# EAGLE design ttn_mad_v2_2 (EAGLE 6.5.0)
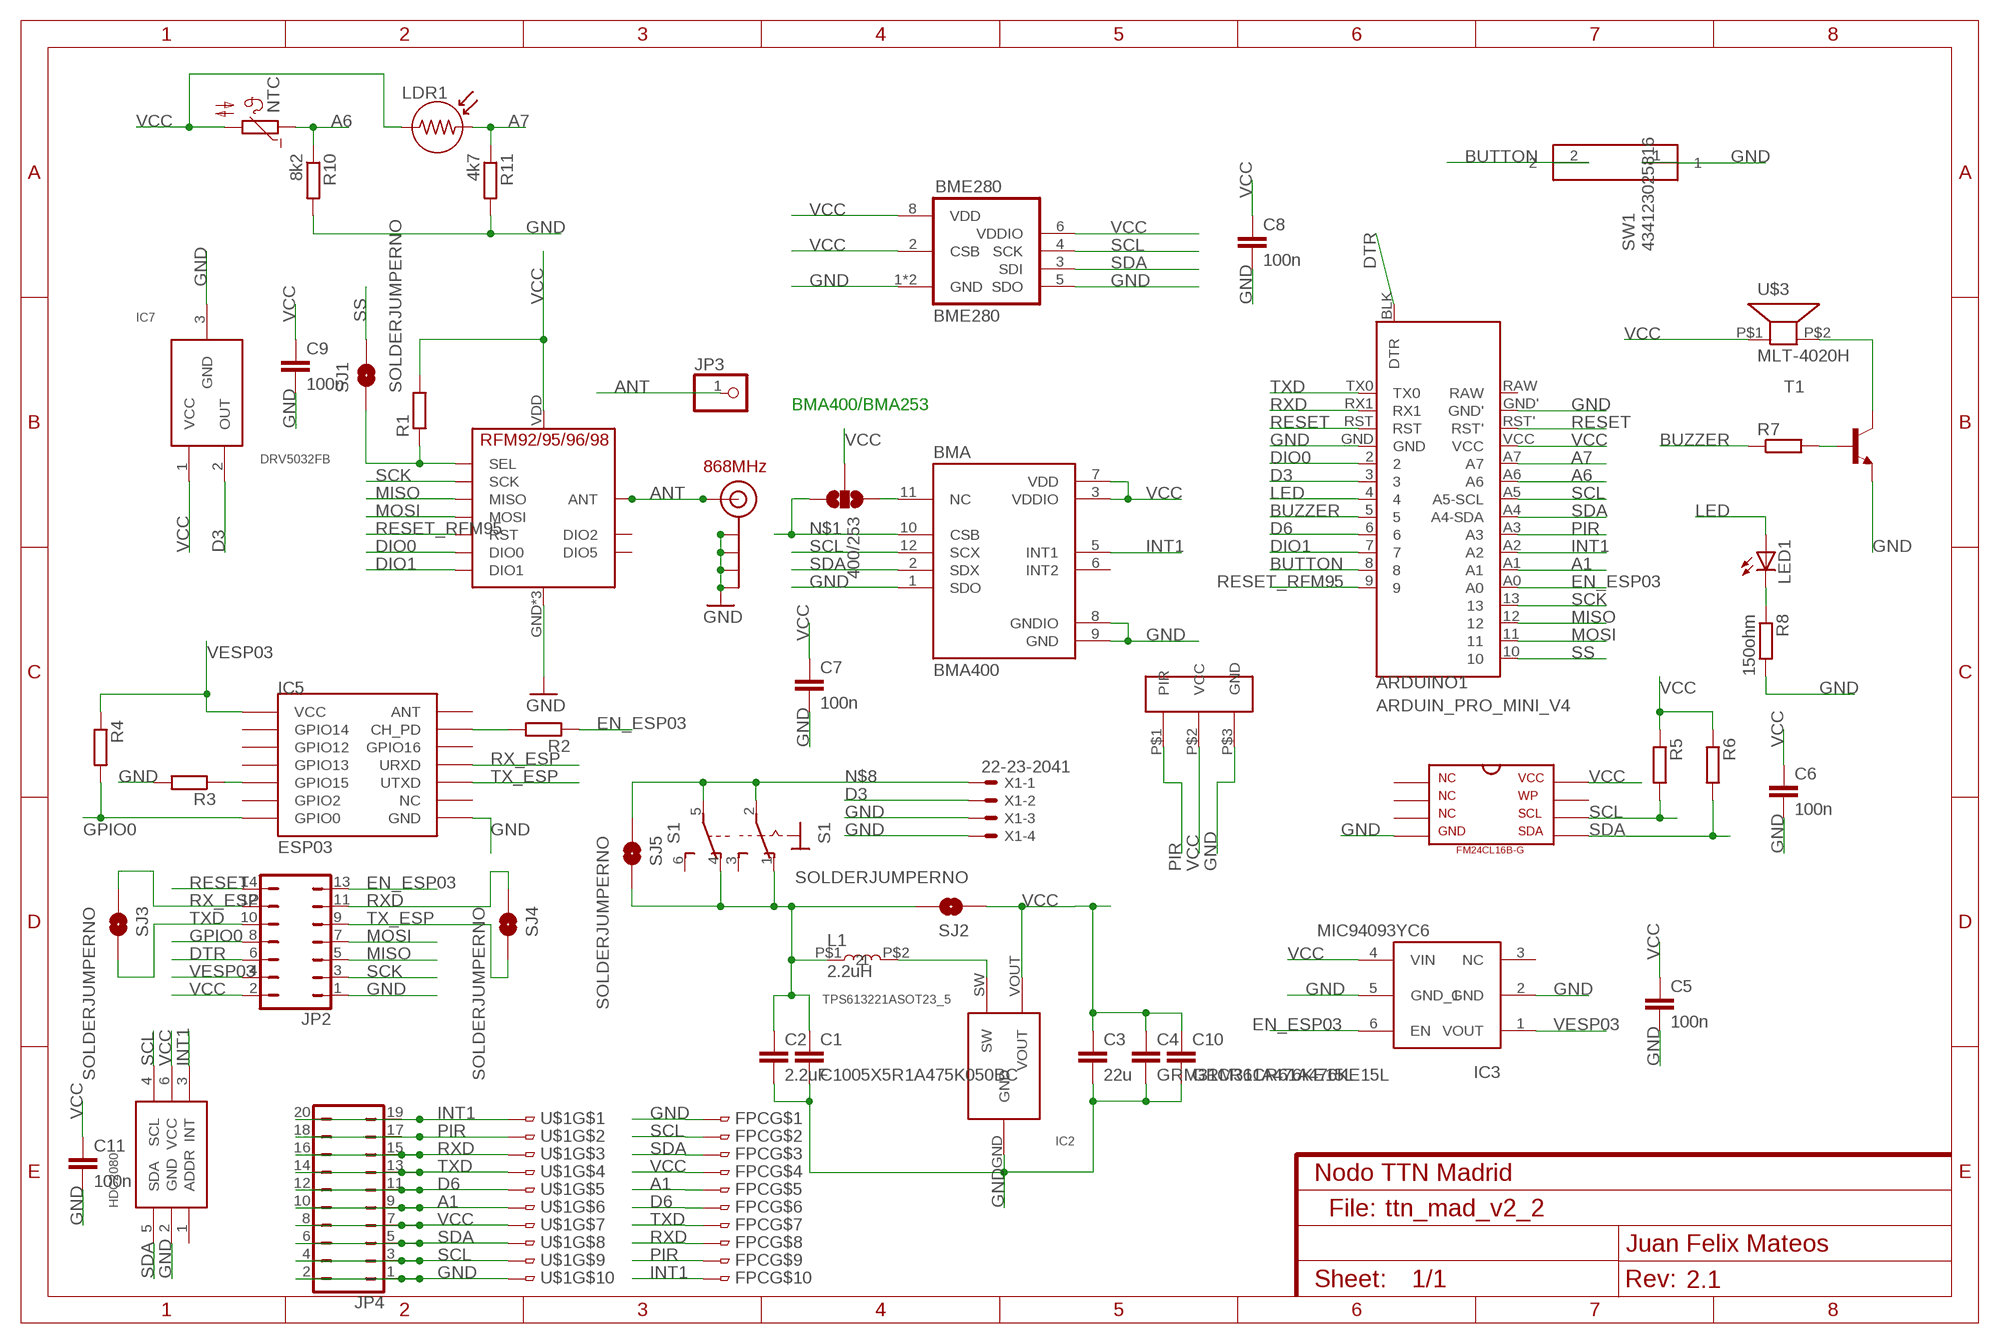
[diagram p0: schematic, sheet 1]
NAME (FRAME-A4L): CNAME: Nodo TTN Madrid; CREVISION: 2.1; DESIGNER: Juan Felix Mateos

## Parts
400/253  SOLDERJUMPER_2WAYT  [SJ_2]
ARDUINO1  ARDUIN_PRO_MINI_V4  [ARDUINO_PRO_MINI_V4]
BMA  BMA400  [IC_BMA400]
BME280  BME280  [BME280]
C1  C1005X5R1A475K050BC  C-EUC0603  [C0603]
C2  2.2uF  C-EUC0603  [C0603]
C3  22u  C-EUC0805  [C0805]
C4  GRM31CR61A476KE15L  C-EUC0805  [C0805]
C5  100n  C-EUC0603  [C0603]
C6  100n  C-EUC0603  [C0603]
C7  100n  C-EUC0603  [C0603]
C8  100n  C-EUC0603  [C0603]
C9  100n  C-EUC0603  [C0603]
C10  GRM31CR61A476KE15L  C-EUC0805  [C0805]
C11  100n  C-EUC0603  [C0603]
FM24  FM24CL16B-G  [FM24CL16B-G]
FPC  FPC_10P_0_5MM  [FH12-10S-0.5SH]
HDC2080  HDC2080  [WSON-6]
IC2  TPS613221ASOT23_5  [SOT23-5L]
IC3  MIC94093YC6  [SC70-6]
IC5  ESP03  [ESP03]
IC7  DRV5032FB  [SOT23]
J$2  ANTENNATINY  [SMA_UFL_PAD_TINY]
JP2  JP7Q  [JP7Q]
JP3  PINHD-1X1  [1X01]
JP4  JP10Q  [JP10Q]
L1  2.2uH  SRN2512  [SRN2512]
LDR1  LDR  [LDR]
LED1  LEDSMT1206  [1206]
NTC  NTC640  [P640]
R1  R-EU_R0603  [R0603]
R2  R-EU_R0603  [R0603]
R3  R-EU_R0603  [R0603]
R4  R-EU_R0603  [R0603]
R5  R-EU_R0603  [R0603]
R6  R-EU_R0603  [R0603]
R7  R-EU_R0603  [R0603]
R8  150ohm  R-EU_R0603  [R0603]
R10  8k2  R-EU_R0603  [R0603]
R11  4k7  R-EU_R0603  [R0603]
S1  TOGGLE_SWITCHTS_SMD  [TOGGLE_SWITCH_SMD]
SJ1  SOLDERJUMPERNO  [SJ_2S-NO]
SJ2  SOLDERJUMPERNO  [SJ_2S-NO]
SJ3  SOLDERJUMPERNO  [SJ_2S-NO]
SJ4  SOLDERJUMPERNO  [SJ_2S-NO]
SJ5  SOLDERJUMPERNO  [SJ_2S-NO]
SW1  434123025816  [434123025816]
T1  BC817-16-NPN-SOT23-BEC  [SOT23-BEC]
U$1  FPC_10P_0_5MM  [FH12-10S-0.5SH]
U$3  MLT-4020H  [MLT-4020H]
U$5  RFM95  [RFM95]
U$6  PIR  [PIR]
X1  22-23-2041  [22-23-2041]

## Nets
A1: ARDUINO1.A1 FPC.5 JP4.9 JP4.10 U$1.6
A6: ARDUINO1.A6 NTC.1 R10.1
A7: ARDUINO1.A7 LDR1.2 R11.1
ANT: J$2.ANT1(SIGNAL) J$2.ANT2(SIGNAL) J$2.ANT3(SIGNAL) JP3.1 U$5.ANT
BUTTON: ARDUINO1.8 SW1.2
BUZZER: ARDUINO1.5 R7.1
D3: ARDUINO1.3 IC7.2(OUT) X1.2
D6: ARDUINO1.6 FPC.6 JP4.11 JP4.12 U$1.5
DIO0: ARDUINO1.2 U$5.DIO0
DIO1: ARDUINO1.7 U$5.DIO1
DTR: ARDUINO1.BLK(DTR) JP2.6
EN_ESP03: ARDUINO1.A0 IC3.6(EN) JP2.13 R2.1
GND [power]: ARDUINO1.GND ARDUINO1.GND' BMA.1(SDO) BMA.8(GNDIO) BMA.9(GND) BME280.1(GND) BME280.5(SDO) BME280.7(GND) C1.2 C2.2 C3.2 C4.2 C5.2 C6.2 C7.2 C8.2 C9.2 C10.2 C11.2 FM24.4 FPC.1 HDC2080.2(GND) IC2.GND IC3.2(GND) IC3.5(GND_1) IC5.GND IC7.3(GND) J$2.GND1(GND) J$2.GND2(GND) J$2.GND3(GND) J$2.GND4(GND) JP2.1 JP4.1 JP4.2 R3.2 R8.2 R10.2 R11.2 SW1.1 T1.E U$1.10 U$5.GND U$5.GND1(GND) U$5.GND2(GND) U$6.P$3(GND) X1.3 X1.4
GPIO0: IC5.GPIO0 JP2.8 R4.2
INT1: ARDUINO1.A2 BMA.5(INT1) FPC.10 HDC2080.3(INT) JP4.19 JP4.20 U$1.1
LED: ARDUINO1.4 LED1.A
MISO: ARDUINO1.12 JP2.5 U$5.MISO
MOSI: ARDUINO1.11 JP2.7 U$5.MOSI
N$1: 400/253.3 BMA.10(CSB)
N$2: R1.1 SJ1.1 U$5.NSS(SEL)
N$3: IC2.SW L1.P$2
N$4: IC5.GPIO15 R3.1
N$5: T1.C U$3.P$2
N$6: 400/253.1 BMA.11(NC)
N$7: R7.2 T1.B
N$8 [power]: S1.2(1:P) S1.5(B:P) SJ5.1 X1.1
N$9: LED1.C R8.1
N$11: IC5.CH_PD R2.2
PIR: ARDUINO1.A3 FPC.9 JP4.17 JP4.18 U$1.2 U$6.P$1(PIR)
RESET: ARDUINO1.RST ARDUINO1.RST' JP2.14
RESET_RFM95: ARDUINO1.9 U$5.RST
RX_ESP: IC5.URXD JP2.12 SJ3.1
RXD: ARDUINO1.RX1 FPC.8 JP2.11 JP4.15 JP4.16 SJ4.1 U$1.3
SCK: ARDUINO1.13 JP2.3 U$5.SCK
SCL: ARDUINO1.A5(A5-SCL) BMA.12(SCX) BME280.4(SCK) FM24.6 FPC.2 HDC2080.4(SCL) JP4.3 JP4.4 R5.2 U$1.9
SDA: ARDUINO1.A4(A4-SDA) BMA.2(SDX) BME280.3(SDI) FM24.5 FPC.3 HDC2080.5(SDA) JP4.5 JP4.6 R6.2 U$1.8
SS: ARDUINO1.10 SJ1.2
TX_ESP: IC5.UTXD JP2.9 SJ4.2
TXD: ARDUINO1.TX0 FPC.7 JP2.10 JP4.13 JP4.14 SJ3.2 U$1.4
VCC [power]: 400/253.2 ARDUINO1.VCC BMA.3(VDDIO) BMA.7(VDD) BME280.2(CSB) BME280.6(VDDIO) BME280.8(VDD) C3.1 C4.1 C5.1 C6.1 C7.1 C8.1 C9.1 C10.1 C11.1 FM24.8 FPC.4 HDC2080.6(VCC) IC2.VOUT IC3.4(VIN) IC7.1(VCC) JP2.2 JP4.7 JP4.8 LDR1.1 NTC.2 R1.2 R5.1 R6.1 SJ2.1 U$1.7 U$3.P$1 U$5.VDD(VCC) U$6.P$2(VCC)
VCC_BAT [power]: C1.1 C2.1 L1.P$1 S1.1(1:O) S1.4(B:O) SJ2.2 SJ5.2
VESP03 [power]: IC3.1(VOUT) IC5.VCC JP2.4 R4.1
Unconnected: ARDUINO1.RAW BMA.6(INT2) FM24.1 FM24.2 FM24.3 FM24.7 HDC2080.1(ADDR) IC3.3(NC) IC5.ANT IC5.GPIO2 IC5.GPIO12 IC5.GPIO13 IC5.GPIO14 IC5.GPIO18(GPIO16) IC5.NC S1.3(1:S) S1.6(B:S) U$5.DIO2 U$5.DIO5

## Notes on the sheet
- BMA400/BMA253
- 868MHz
- File:

## Library data of the parts
400/253 = SparkFun-Passives:SOLDERJUMPER_2WAY: Solder Jumper 2 way solder jumper
ARDUINO1 = Arduino_Pro_Mini:ARDUIN_PRO_MINI_V4
BMA = BMA400:BMA400: Ultra low power, 12-bit digital triaxial accelerometer; AVAILABILITY: Unavailable; DESCRIPTION: Ultra low power, 12-bit digital triaxial accelerometer; MF: Bosch Sensortec; MP: BMA400; PACKAGE: LGA-12 Bosch Tools; PRICE: None
BME280 = bosch-bme280:BME280: DIGITAL HUMIDITY, PRESSURE AND TEMPERATURE SENSOR * Digital interface I²C (up to 3.4 MHz) and SPI (3 and 4 wire, up to 10 MHz)* Supply voltage VDD main supply voltage range: 1.71 V to 3.6 V*VDDIO interface voltage range: 1.2 V to 3.6 V Operating range -40…+85 °C, 0…100 % rel. humidity, 300…1100 hPa The library has been designed by Richard Magdycz <https://www.facebook.com/groups/eaglecadsoftUK>
C1-C11 = rcl:C-EU: CAPACITOR, European symbol
FM24 = FM24CL16B-G_fram:FM24CL16B-G: 16-Kbit (2K × 8) Serial (I2C) F-RAM
FPC U$1 = fpc_10pin_0_5mm:FPC_10P_0_5MM
HDC2080 = hdc2080:HDC2080
IC2 = TPS613221A:TPS613221A
IC3 = MIC94093YC6:MIC94093YC6
IC5 = esp8266modules:ESP03: ESP8266 Wifi module 03; DIMENSIONS: 17.3 x 12.1 mm; PINS: 14; PITCH: 0.078" / 2 mm
IC7 = DRV5032FB:DRV5032FB
J$2 = _c2h:ANTENNA: SMA Antenna Connector End launch SMA connector. The paste layer has been removed so that the connector can be hand soldered onto the board after reflow.
JP2 = jumper:JP7Q: JUMPER
JP3 = pinhead:PINHD-1X1: PIN HEADER
JP4 = jumper:JP10Q: JUMPER
L1 = 1286AS-H-2R2M:SRN2512
LDR1 = EYR_Sensores:LDR: Fotoresistencia
LED1 = led:LED: LED OSRAM: - CHIPLED LG R971, LG N971, LY N971, LG Q971, LY Q971, LO R971, LY R971 LH N974, LH R974 LS Q976, LO Q976, LY Q976 LO Q996 - Hyper CHIPLED LW Q18S LB Q993, LB Q99A, LB R99A - SideLED LS A670, LO A670, LY A670, LG A670, LP A670 LB A673, LV A673, LT A673, LW A673 LH A674 LY A675 LS A676, LA A676, LO A676, LY A676, LW A676 LS A679, LY A679, LG A679 - Hyper Micro SIDELED® LS Y876, LA Y876, LO Y876, LY Y876 LT Y87S - SmartLED LW L88C, LW L88S LB L89C, LB L89S, LG L890 LS L89K, LO L89K, LY L89K LS L896, LA L896, LO L896, LY L896 - TOPLED LS T670, LO T670, LY T670, LG T670, LP T670 LSG T670, LSP T670, LSY T670, LOP T670, LYG T670 LG T671, LOG T671, LSG T671 LB T673, LV T673, LT T673, LW T673 LH T674 LS T676, LA T676, LO T676, LY T676, LB T676, LH T676, LSB T676, LW T676 LB T67C, LV T67C, LT T67C, LS T67K, LO T67K, LY T67K, LW E67C LS E67B, LA E67B, LO E67B, LY E67B, LB E67C, LV E67C, LT E67C LW T67C LS T679, LY T679, LG T679 LS T770, LO T770, LY T770, LG T770, LP T770 LB T773, LV T773, LT T773, LW T773 LH T774 LS E675, LA E675, LY E675, LS T675 LS T776, LA T776, LO T776, LY T776, LB T776 LHGB T686 LT T68C, LB T68C - Hyper Mini TOPLED® LB M676 - Mini TOPLED Santana® LG M470 LS M47K, LO M47K, LY M47K Source: http://www.osram.convergy.de LUXEON: - LUMILED® LXK2-PW12-R00, LXK2-PW12-S00, LXK2-PW14-U00, LXK2-PW14-V00 LXK2-PM12-R00, LXK2-PM12-S00, LXK2-PM14-U00 LXK2-PE12-Q00, LXK2-PE12-R00, LXK2-PE12-S00, LXK2-PE14-T00, LXK2-PE14-U00 LXK2-PB12-K00, LXK2-PB12-L00, LXK2-PB12-M00, LXK2-PB14-N00, LXK2-PB14-P00, LXK2-PB14-Q00 LXK2-PR12-L00, LXK2-PR12-M00, LXK2-PR14-Q00, LXK2-PR14-R00 LXK2-PD12-Q00, LXK2-PD12-R00, LXK2-PD12-S00 LXK2-PH12-R00, LXK2-PH12-S00 LXK2-PL12-P00, LXK2-PL12-Q00, LXK2-PL12-R00 Source: www.luxeon.com KINGBRIGHT: KA-3528ASYC Source: www.kingbright.com
NTC = ptc-ntc:NTC640: PHILIPS NTC; OC_FARNELL: unknown; OC_NEWARK: unknown
R1-R8 R10 R11 = rcl:R-EU_: RESISTOR, European symbol
S1 = vectrex:TOGGLE_SWITCH: TOGGLE SWITCH distributor RS Components
SJ1-SJ5 = SparkFun-Passives:SOLDERJUMPER: Solder Jumper Standard SMD solder jumper. Used to automate production. Two varients : Normally Open and Normally Closed are the same, but have different paste layers. NC will have a large amount of paste and should jumper during reflow.
SW1 = Eagle_Wuerth_Elektronik_Switch:434123025816: WS-TRS-6x3.8 mm J-Bend SMD Tact Switch, 2 pins
T1 = transistor:*-NPN-: NPN Transistror BF959 corrected 2008.03.06
U$3 = buzzer_4020:MLT-4020H
U$5 = _c2h:RFM95
U$6 = pir:PIR
X1 = con-molex:22-23-2041: .100" (2.54mm) Center Header - 4 Pin; MF: MOLEX; MPN: 22-23-2041; OC_FARNELL: 1462920; OC_NEWARK: 38C0355

## Net classes
0 default: width 0.152 mm, drill 0.305 mm, clearance 0.152 mm
1 power: width 0.203 mm, drill 0.305 mm, clearance 0.203 mm
2 GND: width 0.203 mm, drill 0.305 mm, clearance 0.203 mm

## Board
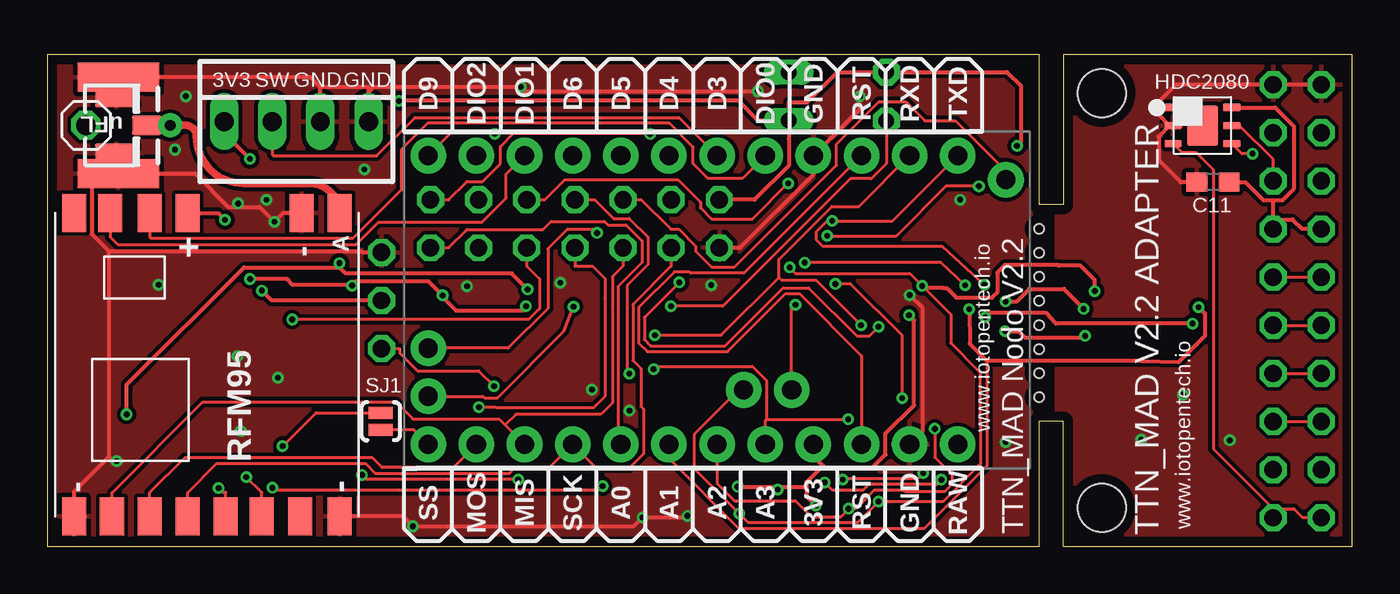
[diagram p1: board, top side]
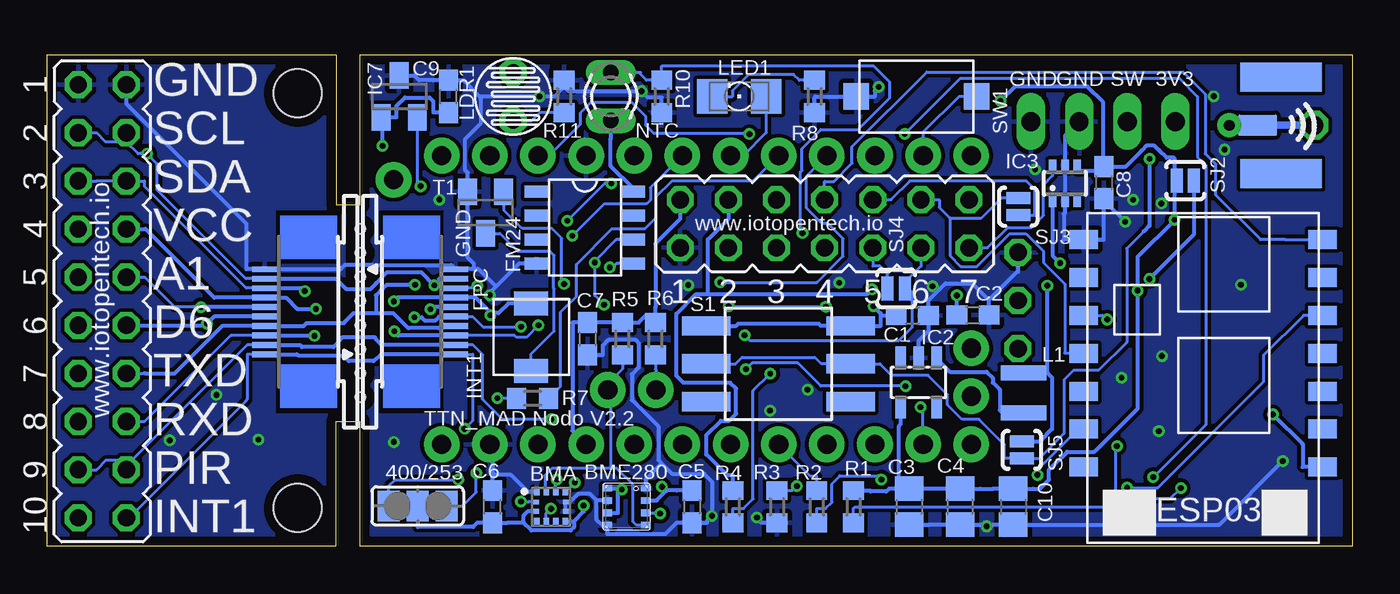
[diagram p2: board, bottom side, seen from below]

Size 68.83 x 25.96 mm. Coordinates in mm from the lower left corner, seen from the top.
Outline: 52.32,25.96 0,25.96 0,0 52.32,0 52.32,6.6 53.59,6.6 53.59,0 68.83,0 68.83,25.96 53.59,25.96 53.59,18.03 52.32,18.03 52.32,25.96
Copper layers (1*16): Top 0.035mm / dielectric 1.5mm / Bottom 0.035mm
Design rules "Mini-Lora_v2_1 *": minimum track width 6mil, minimum drill 12mil, track to track 7mil, track to pad 7mil, pad to pad 7mil, via to via 7mil, smd to smd 0mil, copper to edge 20mil, drill to drill 10mil, minimum pad ring 10mil, minimum via ring 6mil, stop-mask expansion 2mil, vias tented up to drill 12mil, thermal gap 10mil
Holes 2.54 mm at 55.63,23.93 55.63,2.03
Holes 0.51 mm at 52.32,9.14 52.32,10.41 52.32,12.95 52.32,11.68 52.32,14.22 52.32,15.49 52.32,7.87 52.32,16.76

### Footprints (pad centres in the part's own frame; a part is rotated, then mirrored left to right if it is on the bottom)
SJ_2 = smd 1.168 x 1.6: 1 -1.524,0; 2 0,0; 3 1.524,0
ARDUINO_PRO_MINI_V4 = drill 1.016 pad 1.88: 2 -7.62,1.27; 3 -7.62,-1.27; 4 -7.62,-3.81; 5 -7.62,-6.35; 6 -7.62,-8.89; 7 -7.62,-11.43; 8 -7.62,-13.97; 9 -7.62,-16.51; 10 7.62,-16.51; 11 7.62,-13.97; 12 7.62,-11.43; 13 7.62,-8.89; A0 7.62,-6.35; A1 7.62,-3.81; A2 7.62,-1.27; A3 7.62,1.27; A4 4.75,0.127; A5 4.75,2.667; A6 2.54,-16.51; A7 5.08,-16.51; BLK -6.35,13.97; GND -7.62,3.81; GND' 7.62,8.89; RAW 7.62,11.43; RST -7.62,6.35; RST' 7.62,6.35; RX1 -7.62,8.89; TX0 -7.62,11.43; VCC 7.62,3.81
IC_BMA400 = smd 0.3 x 0.35: 1 -0.75,0.775; 4 -0.75,-0.775; 5 -0.25,-0.775; 6 0.25,-0.775; 7 0.75,-0.775; 10 0.75,0.775; 11 0.25,0.775; 12 -0.25,0.775 | smd 0.3 x 0.25: 2 -0.775,0.25; 3 -0.775,-0.25; 8 0.775,-0.25; 9 0.775,0.25
BME280 = smd 0.35 x 0.5: 1 0.975,-1.025; 2 0.325,-1.025; 3 -0.325,-1.025; 4 -0.975,-1.025; 5 -0.975,1.025; 6 -0.325,1.025; 7 0.325,1.025; 8 0.975,1.025
C0603 = smd 1.1 x 1: 1 -0.85,0; 2 0.85,0
C0805 = smd 1.3 x 1.5: 1 -0.95,0; 2 0.95,0
FM24CL16B-G = smd 1.27 x 0.635: 1 -1.27,2.54; 2 -1.27,1.27; 3 -1.27,0; 4 -1.27,-1.27; 5 3.81,-1.27; 6 3.81,0; 7 3.81,1.27; 8 3.81,2.54
FH12-10S-0.5SH = smd 0.3 x 1.3: 1 -2.25,3.25; 2 -1.75,3.25; 3 -1.25,3.25; 4 -0.75,3.25; 5 -0.25,3.25; 6 0.25,3.25; 7 0.75,3.25; 8 1.25,3.25; 9 1.75,3.25; 10 2.25,3.25
WSON-6 = smd 0.4 x 0.9: 1 -0.95,-1.55; 2 0,-1.55; 3 0.95,-1.55; 4 0.95,1.55; 5 0,1.55; 6 -0.95,1.55 | smd 2.15 x 1.65: 7 0,0
SOT23-5L = smd 0.55 x 1.2: 3 0.95,-1.3; 5 -0.95,1.3; GND 0,-1.3; SW -0.95,-1.3; VOUT 0.95,1.3
SC70-6 = smd 0.4 x 0.6: 1 -0.65,-0.95; 2 0,-0.95; 3 0.65,-0.95; 4 0.65,0.95; 5 0,0.95; 6 -0.65,0.95
ESP03 = smd 1.5 x 1: ANT 7.4,4.8; CH_PD 7.4,2.8; GND 7.4,-7.2; GPIO0 -5.2,-7.2; GPIO2 -5.2,-5.2; GPIO12 -5.2,0.8; GPIO13 -5.2,-1.2; GPIO14 -5.2,2.8; GPIO15 -5.2,-3.2; GPIO18 7.4,0.8; NC 7.4,-5.2; URXD 7.4,-1.2; UTXD 7.4,-3.2; VCC -5.2,4.8
SOT23 = smd 1 x 1.4: 1 -0.95,-1.1; 2 0.95,-1.1; 3 0,1.1
SMA_UFL_PAD_TINY = smd 1.524 x 1.016: ANT1 -3.843,0 | drill 0.559 pad 1.27: ANT2 -5.08,0 | smd 2.032 x 1.143 bottom: ANT3 -3.589,0 | smd 2.2 x 1.016: GND1 -2.223,1.47; GND2 -2.223,-1.47 | smd 4.318 x 1.524: GND3 -2.349,-2.54; GND4 -2.349,2.54 | smd 4.318 x 1.524 bottom: GND5 -2.349,2.54; GND6 -2.349,-2.54
JP7Q = drill 0.914 octagon: 1 -7.62,-1.27; 2 -7.62,1.27; 3 -5.08,-1.27; 4 -5.08,1.27; 5 -2.54,-1.27; 6 -2.54,1.27; 7 0,-1.27; 8 0,1.27; 9 2.54,-1.27; 10 2.54,1.27; 11 5.08,-1.27; 12 5.08,1.27; 13 7.62,-1.27; 14 7.62,1.27
1X01 = drill 1.016 octagon: 1 0,0
JP10Q = drill 0.914 octagon: 1 -11.43,-1.27; 2 -11.43,1.27; 3 -8.89,-1.27; 4 -8.89,1.27; 5 -6.35,-1.27; 6 -6.35,1.27; 7 -3.81,-1.27; 8 -3.81,1.27; 9 -1.27,-1.27; 10 -1.27,1.27; 11 1.27,-1.27; 12 1.27,1.27; 13 3.81,-1.27; 14 3.81,1.27; 15 6.35,-1.27; 16 6.35,1.27; 17 8.89,-1.27; 18 8.89,1.27; 19 11.43,-1.27; 20 11.43,1.27
SRN2512 = smd 0.787 x 2.388: P$1 -1.054,0; P$2 1.054,0
LDR = drill 0.813 pad 1.422 octagon: 1 -1.29,0; 2 1.29,0
1206 = smd 1.6 x 1.803: A -1.422,0; C 1.422,0
P640 = drill 0.813 long: 1 -1.27,0; 2 1.27,0
R0603 = smd 1 x 1.1: 1 -0.85,0; 2 0.85,0
TOGGLE_SWITCH_SMD = smd 2.54 x 1.016: 1 -3.81,2; 2 -3.81,0; 3 -3.81,-2; 4 3.81,2; 5 3.81,0; 6 3.81,-2
SJ_2S-NO = smd 0.635 x 1.27: 1 -0.45,0; 2 0.45,0
434123025816 = smd 1.35 x 1.4: 1 -3.175,0; 2 3.175,0
SOT23-BEC = smd 1 x 1.4: B -0.95,-1.1; C 0,1.1; E 0.95,-1.1
MLT-4020H = smd 1.27 x 1.8: P$1 -1.778,0; P$2 1.778,0
RFM95 = smd 2 x 1.27: ANT 5.777,-7; DIO0 5.777,3; DIO1 5.779,5.095; DIO2 5.779,7; DIO5 -10.225,-4.936; GND 5.777,-5; GND1 -10.223,7; GND2 -10.23,-7; MISO -10.23,5; MOSI -10.225,3; NSS -10.223,-1; RST -10.223,-2.905; SCK -10.23,1.012; VDD 5.777,1
PIR = drill 0.914 octagon: P$1 -2.54,0; P$2 0,0; P$3 2.54,0
22-23-2041 = drill 1 long: 1 -3.81,0; 2 -1.27,0; 3 1.27,0; 4 3.81,0

### Placement (x,y rotation side)
400/253  49.3,2.13 180 bottom
ARDUINO1  36.6,13 270 top
BMA  42.27,2.1 0 bottom
BME280  38.28,2.1 90 bottom
C1  23.2,12.18 0 bottom
C2  20,12.2 0 bottom
C3  23.37,2.1 270 bottom
C4  20.69,2.1 270 bottom
C5  34.84,2.1 270 bottom
C6  45.35,2.1 90 bottom
C7  40.34,10.96 270 bottom
C8  13.11,19.2 270 bottom
C9  47.68,23.75 90 bottom
C10  17.88,2.1 270 bottom
C11  61.49,19.23 180 top
FM24  41.74,16.19 0 bottom
FPC  50.55,12.38 270 bottom
HDC2080  60.93,22.21 270 top
IC2  22.87,8.65 180 bottom
IC3  15.15,19.16 0 bottom
IC5  6.76,8.99 180 bottom
IC7  50.27,23.75 0 bottom
J$2  1.4,22.23 180 top
JP2  27.83,17.03 0 bottom
JP3  2.03,22.23 0 top
JP4  65.94,12.94 270 bottom
L1  17.34,8.1 270 bottom
LDR1  44.26,23.75 270 bottom
LED1  32.33,23.75 180 bottom
NTC  39.12,23.75 270 bottom
R1  26.3,2.1 90 bottom
R2  28.24,2.1 270 bottom
R3  30.34,2.1 270 bottom
R4  32.66,2.1 270 bottom
R5  38.49,10.96 270 bottom
R6  36.75,10.96 270 bottom
R7  43.24,7.81 180 bottom
R8  28.36,23.75 270 bottom
R10  36.42,23.75 270 bottom
R11  41.57,23.75 90 bottom
S1  30.26,9.64 0 bottom
SJ1  17.59,6.6 270 top
SJ2  8.8,19.32 0 bottom
SJ3  17.61,17.93 270 bottom
SJ4  24.05,13.61 180 bottom
SJ5  17.42,5.09 90 bottom
SW1  22.99,23.75 0 bottom
T1  45.71,17.61 180 bottom
U$1  54.13,12.38 90 bottom
U$3  43.31,11.05 270 bottom
U$5  8.41,11.81 90 top
U$6  17.63,12.98 90 bottom
X1  13.13,22.43 0 top

### Tracks (layer width: path | path; a pad name or v marks a point on that pad's centre or on a via)
A1  (via drill 0.3 pad 0.61)
  Top 0.152: ARDUINO1.A1 32.79,4.64 36.47,0.96 46.28,0.96 49.59,4.28 49.59,9.75 | JP4.10 JP4.9
  Top 0.203: v60.73,12.62 v60.74,12.62 61.07,12.29 61.07,11.11 60.64,10.68 60.07,10.11 59.69,9.73 57.75,9.78 49.61,9.78 49.59,9.75 48.66,10.68 v48.63,12.51
  Bottom 0.152: JP4.10 63.7,14.21 62.12,12.63 U$1.6
  Bottom 0.203: U$1.6 60.72,12.63 v60.73,12.62 | FPC.5 48.51,12.63 v48.63,12.51
A6  (via drill 0.3 pad 0.61)
  Top 0.152: v29,16.54 28.81,16.73 27.42,16.73 26.4,15.71 26.4,12.56 24.31,10.46 ARDUINO1.A6
  Bottom 0.152: v29,16.54 29.1,16.64 29.1,19.77 29.02,19.85 29.02,21 28.03,22 26.07,22 24.39,23.68 24.39,24.51 25.23,25.35 36.42,25.35 R10.1 36.83,24.6 37.23,24.6 37.54,24.91 37.54,25.02 NTC.1
A7  (via drill 0.3 pad 0.61)
  Top 0.152: LDR1.2 44.26,20.2 43.47,19.41 42.37,19.41 35.64,12.68 v32.9,12.68 | ARDUINO1.A7 22.98,7.93 23.06,7.85 23.74,7.85 27.25,11.36 v27.76,12.65
  Bottom 0.152: v32.9,12.68 v27.76,12.65 | LDR1.2 43.29,22.46 42.85,22.9 R11.1
ANT
  Top 0.152: J$2.ANT2 J$2.ANT1 | J$2.ANT1
  Top 0.203: J$2.ANT1 J$2.ANT2
  Top 0.406: U$5.ANT arc90 13.84,19.15 10.36,19.15 arc-90 7.86,21.65 arc90 7.29,22.23 J$2.ANT2
  Bottom 0.152: J$2.ANT2 J$2.ANT3 | J$2.ANT3
  Bottom 0.203: J$2.ANT3
  Bottom 0.406: J$2.ANT3 JP3.1
BUTTON
  Bottom 0.152: SW1.2 20.74,23.75 22.63,21.86 ARDUINO1.8
BUZZER
  Bottom 0.152: R7.1 41.77,8.44 41.77,12.36 40.93,13.2 40.93,14.88 39.05,16.76 37.31,16.76 36.71,17.36 36.71,18.45 35.87,19.3 31.58,19.3 ARDUINO1.5
D3  (via drill 0.3 pad 0.61)
  Top 0.152: v41.14,16.39 44.78,16.39 47.4,19.01 v49.14,19.01 | X1.2 11.86,20.67 11.91,20.61 17.37,20.61 19.4,22.64 33.32,22.64 ARDUINO1.3
  Bottom 0.152: ARDUINO1.3 37.02,18.94 37.02,18.29 37.23,18.08 39.46,18.08 v41.14,16.39 | IC7.2 49.32,19.19 v49.14,19.01
D6  (via drill 0.3 pad 0.61)
  Top 0.152: v33.34,13.93 31.5,12.09 31.5,10.92 31.83,10.59 35.76,10.59 38.82,13.65 40.16,13.65 42.7,11.11 43.36,11.11 v43.85,11.59 | JP4.12 JP4.11
  Top 0.203: v60.41,11.76 53.21,11.76 52.7,12.32 49.71,12.32 v49.48,12.09 49.66,12.27
  Bottom 0.152: v33.34,13.93 28.24,13.93 26.86,15.32 26.86,16.23 27.66,17.03 27.97,17.03 28.8,17.86 28.8,19.54 ARDUINO1.6 | FPC.6 46.39,12.13 45.85,11.59 v43.85,11.59
  Bottom 0.203: U$1.5 60.04,12.13 v60.41,11.76 60.5,11.67 JP4.12 | v49.48,12.09 49.08,12.09 48.92,11.92 48.36,11.92 48.17,12.12 47.31,12.12 FPC.6
DIO0
  Top 0.152: ARDUINO1.2 36.67,19.42 34.84,19.42 34.06,20.21 34.06,21.09 32.82,22.33 20.06,22.33 18.67,20.94 18.67,18.8 16.11,16.25 5.49,16.25 5.41,16.33 U$5.DIO0
DIO1
  Top 0.152: U$5.DIO1 3.31,16.34 3.7,15.94 16.29,15.94 17.46,17.12 22.93,17.12 24.21,18.4 24.21,19.66 ARDUINO1.7
DTR
  Top 0.152: ARDUINO1.BLK 50.57,19.8 47.9,22.46 46.29,22.46 45.28,23.47 43.87,23.47 41.63,21.24 41.63,20.12 36.26,14.75 35.03,14.75 34.2,15.58 34.2,15.85 33.31,16.74 32.9,16.74 31.33,18.3 JP2.6
EN_ESP03
  Top 0.152: ARDUINO1.A0 30.11,5.52 30.11,13.73 31.38,14.99 31.38,16.12 30.52,16.97 29.57,16.97 29.38,17.16 26.58,17.16 26.15,16.73 22.14,16.73 21.17,15.76 JP2.13
  Bottom 0.152: R2.1 28.24,3.7 28.57,3.7 ARDUINO1.A0 | IC3.6 15.8,19.56 16.29,19.07 16.29,17.47 16.93,16.83 18.17,16.83 19.24,15.76 JP2.13
GND  (via drill 0.3 pad 0.61)
  Top 0.203: 3.62,19.69 J$2.GND4 | J$2.GND2 | 3.26,15.56 2.37,16.45 2.37,19.69 J$2.GND4 | 14.4,24.24 13.88,24.77 J$2.GND3 J$2.GND2 | 14.4,24.24 14.4,24.14 X1.3 | 3.26,15.56 3.23,15.54 3.23,4.72 | 3.26,15.56 16.57,15.56 16.61,15.52 U$6.P$3 | 3.23,4.72 3.45,4.5 v3.66,4.5 | 3.23,4.72 1.41,2.89 U$5.GND1 | 16.94,23.98 17.21,24.25 v24.97,24.25 25.19,24.03 v37.49,24.03 | ARDUINO1.GND' 46.18,6.07 46.18,12.58 v45.49,13.26 | v42.86,23.75 42.86,23.07 ARDUINO1.GND 40.41,19.63 36.54,15.76 36.46,15.76 JP2.1 | v33.77,1.61 33.7,1.53 v31.4,1.53 30.94,1.06 v19.28,1.06 18.77,1.58 U$5.GND2 | 16.94,23.98 16.94,24.24 14.4,24.24 | X1.4 16.94,23.98 | 3.56,19.69 3.62,19.69 | 3.62,19.69 J$2.GND1 | J$2.GND1 | J$2.GND2 | U$5.GND 12.43,17.59 v11.98,17.13 | 11.96,17.12 v11.98,17.13 | J$2.GND4 7.79,19.69 9.55,17.92 11.19,17.92 v11.98,17.13 | 59.2,22.21 HDC2080.2 | 59.2,22.21 58.58,22.83 58.58,23.42 59.53,24.37 JP4.2 JP4.1 | 59.2,22.21 58.63,21.64 58.63,20.39 59.79,19.23 C11.2
  Bottom 0.203: 45.96,23.75 46.02,23.75 46.87,24.6 C9.2 48.08,24.6 48.48,24.6 49.21,24.6 49.46,24.85 IC7.3 | 45.96,23.75 v42.86,23.75 42.08,23.75 41.57,24.26 | 45.96,23.75 45.96,22.33 46.79,21.5 46.79,19.85 46.66,19.72 T1.E 46.66,15.25 46.34,14.93 46.34,14.66 46.32,14.63 | U$6.P$3 17.63,14.5 17.66,14.5 19.15,13.01 | v3.66,4.5 7.01,1.15 C10.2 18.41,1.15 18.94,1.15 19.02,1.06 v19.28,1.06 19.55,1.06 19.63,1.15 C4.2 22.31,1.15 22.84,1.15 C3.2 | 39.86,2.42 40.2,2.77 40.84,2.77 41.27,2.35 BMA.9 41.49,2.27 BMA.8 | 45.17,13.71 46.1,14.63 46.32,14.63 | BMA.1 43.47,2.87 44.4,3.8 45.35,3.8 | 45.17,13.71 43.95,14.92 FM24.4 | v45.49,13.26 45.49,13.39 45.17,13.71 | 36.42,4.38 35.87,3.83 34.19,3.83 33.77,3.42 v33.77,1.61 34.03,1.35 34.03,1.25 C5.2 35.64,1.25 36.25,0.64 39.3,0.64 39.3,1.02 | 36.42,4.38 36.6,4.56 36.6,6.33 38,7.72 38,9.08 37.64,9.44 37.64,10.74 37.82,10.91 39.23,10.91 39.53,10.61 39.53,10.11 C7.2 | 36.42,4.38 37.25,3.55 BME280.1 | 41.57,24.26 41.34,24.03 v37.49,24.03 37.16,23.7 36.42,23.7 R10.2 | 19.15,13.01 20.03,13.88 21.45,13.88 22.35,12.98 C1.2 22.35,11.89 22.35,11.37 22.87,10.86 IC2.GND | ARDUINO1.GND' 45.35,5.24 45.35,3.8 | C6.2 45.35,3.8 | v24.97,24.25 25.18,24.04 25.18,23.75 SW1.1 28.31,23.75 28.36,23.7 R8.2 | X1.3 15.15,21.68 IC3.5 IC3.2 15.15,17.61 15.21,17.55 15.21,16.19 IC5.GND 13.1,16.19 13.1,17.99 12.72,18.38 C8.2 13.11,18.26 v11.98,17.13 | R3.2 31.2,1.25 31.2,1.32 v31.4,1.53 | C2.2 19.15,13.01 | R11.2 41.57,24.26 | 39.3,1.02 39.47,1.02 39.86,1.41 39.86,2.42 | BME280.5 39.3,1.02 | BME280.7 39.86,2.42 | JP4.2 64.67,23.36 58.33,17.02 58.33,14.63 U$1.10 53.36,14.63 53.31,14.68 53.14,14.86 51.68,14.86 47.52,14.86 FPC.1 46.32,14.63
  other vias: 6.73,20.94 10.06,18.1 7.3,23.76 5.87,13.8 10.03,10.05 10.2,6.08 12.17,8.9 22.14,13.73 50.56,5.51 27.06,13.92 28.73,8.27 30.71,7.16 35.03,13.79 48.16,18.3 62.38,5.6 59.92,8 57.7,5.64 16.73,19.9 11.56,18.29
  pour Top: -0.95,26.85 52.63,26.76 52.63,-0.5 -0.66,-0.38
  pour Bottom: -1.88,27.39 52.68,27.22 52.86,-0.61 -1.93,-1.02
  pour Bottom: 70.89,27.98 53.15,27.62 53.26,-0.97 70.6,-0.74
  pour Top: 70.02,26.94 53.2,26.81 53.26,-2.24 70.42,-1.96
GPIO0  (via drill 0.3 pad 0.61)
  Top 0.152: JP2.8 28.87,18.3 29.86,17.31 30.7,17.31 31.68,16.32 31.68,14.87 30.58,13.76 30.58,9.24 v30.7,9.12
  Bottom 0.152: v30.7,9.12 31.6,8.22 31.6,2.5 32.1,2 32.66,2 R4.2 | JP2.8 27.83,19.27 27.34,19.27 26.38,20.23 26.38,21.1 22.44,25.04 9.69,25.04 8.91,25.04 7.75,23.88 7.75,20.73 7.19,20.17 7.19,18.55 4.82,16.19 3.54,16.19 IC5.GPIO0
INT1  (via drill 0.3 pad 0.61)
  Top 0.152: ARDUINO1.A2 35.33,3.34 36.26,2.41 39.46,2.41 40.3,1.57 41.85,1.57 v42.27,1.99 42.65,1.99 43.62,2.96 45.17,2.96 45.25,2.88 47.33,2.88 47.72,3.28 47.72,3.79 46.82,4.69 v46.82,6.21 | HDC2080.3 59.84,20.81 60.58,20.81 61.51,19.88 61.51,5.15 64.67,1.99 | 64.67,1.99 65.76,1.99 66.24,1.51 JP4.19 | JP4.20 64.67,1.99
  Bottom 0.152: v46.82,6.21 46.39,6.63 46.39,10.13 FPC.10 | BMA.5 42.52,1.75 42.51,1.75 v42.27,1.99 | U$1.1 58.28,10.13 58.28,8.86 58.28,7.76 58.36,7.68 64.53,1.51 JP4.20
  Bottom 0.203: FPC.10 51.21,10.13 51.63,9.78 52.93,9.78 53.24,10.08 55.61,10.08 55.66,10.13 U$1.1
LED
  Bottom 0.152: LED1.A 30.91,21.83 32.12,20.62 ARDUINO1.4
MISO
  Top 0.152: JP2.5 30.37,14.79 29.81,14.24 29.81,12.69 29.81,7.58 29.2,6.97 24.71,6.97 24.15,6.41 | 24.15,6.41 23.84,6.72 19.29,6.72 18.39,7.63 8.2,7.63 3.41,2.83 U$5.MISO | 24.15,6.41 ARDUINO1.12
MOSI  (via drill 0.3 pad 0.61)
  Top 0.152: v22.77,7.35 23.66,7.35 28.85,7.35 28.94,7.44 29.41,7.91 29.41,13.09 29.41,14.15 28.77,14.79 27.83,14.79 JP2.7 | ARDUINO1.11 21.42,4.17 17.66,4.17 17.15,4.68 7.25,4.68 5.41,2.84 U$5.MOSI
  Bottom 0.152: ARDUINO1.11 22.63,7.21 v22.77,7.35
N$1  (via drill 0.3 pad 0.61)
  Top 0.152: v47.16,3.52 46.91,3.26 43.34,3.26 43.03,2.96 41.43,2.96 v41.01,3.38
  Bottom 0.152: BMA.10 v41.01,3.38 | v47.16,3.52 50.5,3.52 50.83,3.19 400/253.3
N$2  (via drill 0.3 pad 0.61)
  Top 0.152: v12.41,5.29 14.17,7.05 SJ1.1 | U$5.NSS 9.41,2.84 9.26,2.84 v9.03,3.07
  Bottom 0.152: 12.47,2.53 9.58,2.53 v9.03,3.07 | 12.47,2.53 12.92,2.08 26.23,2.08 26.3,2 R1.1 | 12.47,2.53 12.47,5.23 v12.41,5.29
N$3
  Bottom 0.203: IC2.SW 21.92,9.92 21.22,9.22 19.29,9.22 18.96,8.89 18.96,8.65 18.59,8.28 18.59,7.19 18.41,7.01 17.37,7.01 L1.P$2
N$4  (via drill 0.3 pad 0.61)
  Top 0.152: v29.29,3.19 29.07,2.97 12,2.97 v11.87,3.09
  Bottom 0.152: v11.87,3.09 10.26,3.09 4.66,8.7 4.66,10.09 2.56,12.19 IC5.GPIO15 | R3.1 29.53,2.95 v29.29,3.19
N$5
  Bottom 0.152: T1.C 44.95,16.52 44.01,15.57 42.31,15.57 42.1,15.36 42.1,14.26 42.13,14.22 42.13,13.62 42.1,13.59 42.1,11.37 43.31,10.16 U$3.P$2
N$6  (via drill 0.3 pad 0.61)
  Top 0.152: v46.21,3.86 45.91,3.57 42,3.57 v41.96,3.53
  Bottom 0.152: v46.21,3.86 46.21,2.87 46.94,2.13 400/253.1 | v41.96,3.53 41.96,3.36 42.02,3.3 BMA.11
N$7  (via drill 0.3 pad 0.61)
  Top 0.152: v45.1,7.82 45.1,11.14 42.38,13.86 v41.58,13.86
  Bottom 0.152: v41.58,13.86 41.7,13.98 41.7,16.27 42.22,16.78 43.78,16.78 44.76,17.76 T1.B | v45.1,7.82 44.85,7.82 44.85,7.81 R7.2
N$8  (via drill 0.3 pad 0.61)
  Top 0.203: X1.1 9.32,21.82 v10.69,20.45
  Bottom 0.152: S1.2 32.52,9.64 32.18,9.98 28.35,9.98 28,9.64 S1.5 24.91,9.64 24.3,9.03 22.37,9.03 21.34,8 21.34,7.46 20.59,6.71 19.69,6.71 18.34,5.36 18.34,4.64 SJ5.1 17.22,4.64 16.51,4.64 15.2,5.95 15.2,8.79 14.7,9.29 13.38,9.29 11.9,10.77 11.9,15.72 10.99,16.63
  Bottom 0.203: v10.69,20.45 10.69,16.93 10.99,16.63
N$9
  Bottom 0.152: LED1.C 32.7,23.75 32.7,24.05 31.84,24.91 29.47,24.91 29.16,24.6 R8.1
N$11  (via drill 0.3 pad 0.61)
  Top 0.152: v24.84,3.53 16.84,3.53 v16.6,3.77
  Bottom 0.152: R2.2 28.24,2 27.77,2 27.44,2.33 27.44,3.31 27.02,3.73 25.03,3.73 v24.84,3.53 | v16.6,3.77 16.6,4.04 14.45,6.19 IC5.CH_PD
PIR  (via drill 0.3 pad 0.61)
  Top 0.152: v31.98,9.36 32.13,9.51 37.2,9.51 37.94,8.77 37.94,6.71 | U$6.P$1 18.59,10.44 18.59,10.2 19.52,9.27 22.75,9.27 v23.56,8.46 | 37.94,6.71 v42.25,6.71 | ARDUINO1.A3 37.87,6.64 37.94,6.71
  Bottom 0.152: v23.56,8.46 28.02,8.46 29.24,9.68 31.66,9.68 v31.98,9.36 | v42.25,6.71 44.82,6.71 45.87,7.76 45.87,10.12 46.38,10.63 FPC.9 | U$1.2 58.28,10.63 64.38,4.53 64.67,4.53 | JP4.17 66.24,4.05 65.76,4.53 64.67,4.53 | JP4.18 64.67,4.53
  Bottom 0.203: FPC.9 51.2,10.63 51.5,10.93 51.55,11.04 53.28,11.04 53.66,10.61 53.75,10.52 55.4,10.52 55.5,10.62 57.36,10.62 U$1.2 57.35,10.61
RESET  (via drill 0.3 pad 0.61)
  Top 0.152: ARDUINO1.RST 36.74,14.42 33.94,14.42 33.86,14.49 33.08,14.49 31.19,12.6 31.19,10.74 31.65,10.28 35.88,10.28 38.94,13.34 39.67,13.34 42.95,10.06 ARDUINO1.RST' | v31.8,21.76 31.74,21.82 24.61,21.82 23.9,21.11 23.9,20.21 22.96,19.27 22.14,19.27 21.17,18.3 JP2.14
  Bottom 0.152: ARDUINO1.RST 42.37,20.62 40.72,22.28 40.72,22.89 40.15,23.45 38.02,23.45 37.28,22.71 37.28,22.23 36.86,21.82 31.85,21.82 v31.8,21.76
RESET_RFM95  (via drill 0.3 pad 0.61)
  Top 0.152: v10.49,3.66 11.31,2.84 U$5.RST | v23.61,21.77 23.55,21.83 21.3,21.83 ARDUINO1.9
  Bottom 0.152: v23.61,21.77 20.68,24.7 11.92,24.7 9.11,24.7 8.15,23.75 8.15,20.56 7.73,20.13 7.73,6.43 v10.49,3.66
RX_ESP
  Bottom 0.152: 21.22,17.33 19.55,17.33 18.5,18.38 SJ3.1 | 21.22,17.33 21.78,17.89 21.78,18.3 JP2.12 | 21.22,17.33 21.22,15.35 20.65,14.78 19.79,14.78 18.06,16.51 17.21,16.51 16.28,15.58 16.28,14.98 15.16,13.86 15.16,10.19 IC5.URXD
RXD  (via drill 0.3 pad 0.61)
  Top 0.152: 38.59,14.19 38.59,15.15 41.38,17.94 42.81,17.94 ARDUINO1.RX1 | v42.93,11.67 40.57,14.04 38.75,14.04 38.59,14.19 | v32.05,11.15 35.55,11.15 38.59,14.19 | JP4.16 JP4.15
  Top 0.203: v54.75,11.11 54.61,11.04 51.56,11.04 51.25,11.35 v50.53,11.35
  Bottom 0.152: JP2.11 22.75,14.79 23.41,14.13 23.41,13.61 | 23.41,13.61 23.22,13.42 23.22,11.55 23.92,10.85 31.76,10.85 v32.05,11.15 | SJ4.1 23.41,13.61 | v42.93,11.67 43.57,11.04 44.08,11.04 44.18,11.13 FPC.8 | JP4.16 63.7,6.59 59.16,11.13 U$1.3
  Bottom 0.203: FPC.8 50.33,11.13 v50.53,11.35 | U$1.3 54.77,11.13 v54.75,11.11
SCK
  Top 0.152: JP2.3 32.91,14.79 30.89,12.78 30.89,9.81 31.31,9.39 31.31,7.39 31.45,7.25 31.45,4.88 30.71,4.15 28.95,4.15 ARDUINO1.13 26.41,4.09 24.6,4.09 24.38,3.87 17.3,3.87 16.78,4.38 8.94,4.38 7.39,2.83 U$5.SCK
SCL  (via drill 0.3 pad 0.61)
  Top 0.152: ARDUINO1.A5 39.27,12.55 v39.47,12.75 | v48.42,13.78 47.15,14.98 v39.95,14.98 | v63.58,20.73 63.02,20.73 HDC2080.4
  Bottom 0.152: 39.12,4.13 42.2,4.13 42.59,3.75 42.59,2.94 BMA.12 | 39.12,4.13 38.8,4.13 37.94,3.27 37.94,1.31 37.76,1.12 BME280.4 | 39.12,4.13 39.12,8.11 ARDUINO1.A5 39.27,8.58 38.49,9.36 R5.2 | v39.47,12.75 39.95,13.23 v39.95,14.98 39.95,15.06 38.82,16.19 FM24.6 | FPC.2 48.2,14.13 48.2,13.92 v48.42,13.78 | 64.67,21.35 64.05,20.73 v63.58,20.73 63.04,20.19 63.04,18.8 58.37,14.13 U$1.9 | JP4.3 66.24,21.83 65.76,21.35 64.67,21.35 | JP4.4 64.67,21.35
  Bottom 0.203: U$1.9 53.62,14.13 53.06,13.59 51.78,13.59 51.5,13.87 51.5,13.88 50.9,14.48 49.12,14.48 v48.42,13.78
SDA  (via drill 0.3 pad 0.61)
  Top 0.152: v39.16,14.72 39.47,14.41 45.49,14.41 v46.16,13.75 47.66,12.25 47.66,10.73 49.23,9.15 49.23,6.32 49.23,4.35 47.24,2.36 v43.85,2.36 42.76,1.27 36.97,1.27 v36.51,1.73 34.12,4.12 34.12,5.9 36.47,8.25 ARDUINO1.A4 | HDC2080.5 62.89,22.21 64.67,20.43 64.67,20.26 JP4.6
  Top 0.203: v55.26,13.47 55.26,14.07 54.51,14.82 53.35,14.82 53.31,14.86 50.52,14.86 50.11,14.45 50.11,13.41 49.83,13.13 47.95,13.13 47.45,13.63 FPC.3 46.27,13.63 v46.16,13.75
  Bottom 0.152: BMA.2 43.45,2.35 43.46,2.36 v43.85,2.36 | R6.2 36.75,9.36 36.73,9.33 ARDUINO1.A4 | FM24.5 38.82,14.92 39.02,14.72 v39.16,14.72 | v46.16,13.75 46.27,13.63 FPC.3 | BME280.3 36.75,1.77 36.71,1.73 v36.51,1.73 | JP4.5 66.24,19.29 JP4.6 63.7,19.29 63.7,18.99 58.34,13.63 U$1.8
  Bottom 0.203: U$1.8 55.42,13.63 v55.26,13.47
SS
  Top 0.152: ARDUINO1.10 19.32,6.15 SJ1.2
TX_ESP  (via drill 0.3 pad 0.61)
  Top 0.152: JP2.9 25.29,14.79 25.97,14.11 25.97,12.56 25.39,11.98 v12.91,11.98
  Bottom 0.152: IC5.UTXD 13.15,12.19 12.94,11.98 v12.91,11.98 | SJ4.2 24.5,14.39 24.91,14.79 25.29,14.79 JP2.9
TXD  (via drill 0.3 pad 0.61)
  Top 0.152: ARDUINO1.TX0 44.59,17.18 v41.41,17.18 41.13,17.18 40.58,16.63 40.58,16.17 40.91,15.83 47.21,15.83 v49.44,13.81 | v39.08,19.16 37.2,17.28 35.05,17.28 34.45,17.87 34.45,18.16 33.27,19.35 27.3,19.35 26.25,18.3 JP2.10 | JP4.14 JP4.13
  Bottom 0.152: v39.08,19.16 39.42,19.16 v41.41,17.18 | JP2.10 24.32,18.3 23.33,19.29 17.19,19.29 16.73,18.83 16.73,17.48 SJ3.2 | JP4.14 63.7,9.13
  Bottom 0.203: 61.77,9.47 59.61,11.63 U$1.4 55.32,11.63 55.17,11.79 53.2,11.79 52.68,12.31 51.5,12.31 | 61.77,9.47 62.13,9.12 | 63.7,9.13 62.12,9.13 61.77,9.47 | FPC.7 48.07,11.63 48.18,11.52 49.8,11.52 50.06,11.78 | 50.06,11.78 50.11,11.84 | 50.06,11.78 50.56,12.28 50.58,12.31 51.5,12.31 | 51.5,12.31 51.5,13.25 51.14,13.61 50.94,13.81 v49.44,13.81
VCC  (via drill 0.3 pad 0.61)
  Top 0.203: 40.05,3.15 40.05,2.65 v40.54,2.16 | U$5.VDD 9.01,17.59 v9.36,17.24 | 40.92,4.26 41.03,4.14 43.51,4.14 44.22,4.85 44.22,5.96 45.72,7.45 45.72,11.94 v45.46,12.2 | ARDUINO1.VCC 40.41,4.76 40.92,4.26 | 40.92,4.26 40.05,3.38 40.05,3.15 | 38.53,3.15 40.05,3.15 | v11.31,13.5 11.84,12.98 16.61,12.98 U$6.P$2 | v18.55,23.51 36.45,23.51 37.49,22.48 NTC.2 | 39.12,21.51 | 39.12,21.51 39.12,20.11 37.31,18.3 JP2.2 | v36.41,3.15 38.53,3.15 | 38.53,3.15 v38.53,3 | NTC.2 39.12,21.51 | NTC.2 39.12,23.44 40.08,23.44 41.68,25.04 LDR1.1 45.28,25.04 50.63,25.04 51.35,24.32 51.35,21.34 v51.16,21.15 | 64.67,18.26 64.17,18.26 63.2,19.23 C11.1 | HDC2080.6 64.78,23.16 65.75,22.19 65.75,18.85 65.16,18.26 64.67,18.26 | 64.67,18.26 64.67,17.77 64.67,17.26 | JP4.7 66.19,16.75 65.68,17.26 64.67,17.26 | JP4.8 64.67,17.26 | v50.56,12.93 51.16,12.93 51.8,13.59 53.63,13.59 v54.67,12.54
  Bottom 0.152: 9.36,19.32 9.36,19.49
  Bottom 0.203: ARDUINO1.VCC 41.14,6.11 41.14,11.81 C7.1 R5.1 37.64,11.81 37.32,12.13 36.75,12.13 | 41.06,1.32 40.54,1.84 v40.54,2.16 | 16.83,3.05 | 16.83,3.05 16.46,3.05 15.99,3.52 15.99,4.04 15.03,5 13.59,5 11.31,7.28 v11.31,13.5 11.31,15.29 v9.36,17.24 9.36,19.32 SJ2.1 | 45.41,12.31 46.24,13.13 FPC.4 50.36,13.13 v50.56,12.93 | 45.41,12.31 45.03,12.31 44.51,12.83 U$3.P$1 | 45.41,12.31 45.41,12.24 v45.46,12.2 | 12.72,20.08 13.13,20.49 13.13,23.44 13.96,24.27 17.8,24.27 v18.55,23.51 | NTC.2 39.12,21.51 | FM24.8 37.94,18.9 39.12,20.08 39.12,21.51 | 39.12,21.51 | IC2.VOUT 23.82,6.44 23.9,6.37 23.9,3.05 | 23.9,3.05 24.42,3.05 24.57,2.9 25.4,2.9 25.45,2.95 R1.2 | 23.9,3.05 C3.1 C4.1 19.63,3.05 18.94,3.05 18.41,3.05 C10.1 16.83,3.05 | 12.72,20.08 12.98,19.81 14.5,19.81 IC3.4 | v38.53,3 38.68,3 38.75,3.07 | 43.7,1.25 43.7,1.64 43.5,1.84 BMA.3 | 41.06,1.32 41.06,1.01 41.23,0.84 43.3,0.84 43.7,1.25 | 43.7,1.25 44.55,1.25 C6.1 46.16,1.25 46.37,1.03 49.3,1.03 400/253.2 | 36.19,2.93 36.7,2.42 BME280.2 | 36.19,2.93 36.17,2.95 35.64,2.95 C5.1 | v36.41,3.15 36.19,2.93 | C9.1 48.48,22.9 48.48,23.49 48.68,23.69 49.97,23.69 50.41,23.25 50.41,22.65 IC7.1 51.16,22.59 v51.16,21.15 | 38.75,3.07 38.75,1.77 BME280.6 | BME280.8 38.75,3.07 | 36.75,12.13 36.75,12.62 36.75,15.98 35.45,17.29 JP2.2 | R6.1 36.75,12.13 | BMA.7 41.06,1.32 | 12.72,20.08 C8.1 11.94,20.05 11.37,20.62 11.1,20.89 10.84,21.15 10.43,21.15 10.2,20.92 10.18,20.92 9.78,20.51 9.41,20.51 9.36,20.46 9.36,19.57 9.36,19.49 | JP4.8 63.65,16.75 60.03,13.13 U$1.7 56.25,13.13 55.65,12.54 v54.67,12.54
VCC_BAT  (via drill 0.3 pad 0.61)
  Top 0.203: 16.08,13.81 12.95,13.81 12.64,14.11 v10.7,14.11 | 16.08,13.81 16.27,14 20.1,14 v20.85,13.24 20.85,13.16 21.56,12.45 25.03,12.45 v25.25,12.67 | v16.08,13.77 16.08,13.81
  Bottom 0.203: 16.08,9.16 15.84,8.92 15.84,6.19 16.48,5.54 SJ5.2 | L1.P$1 16.08,9.16 | 16.08,9.16 v16.08,13.77 | SJ2.2 8.35,16.46 v10.7,14.11 | v20.85,13.24 20.85,13.01 C2.1 | 24.88,12.18 24.88,11.64 S1.4 28.03,11.64 28.15,11.76 32.38,11.76 32.5,11.64 S1.1 | v25.25,12.67 24.88,12.3 24.88,12.18 | 24.88,12.18 C1.1
VESP03  (via drill 0.3 pad 0.61)
  Top 0.203: 15.4,14.73 v15.4,14.95 | v25.33,13.56 24.49,14.4 15.73,14.4 15.4,14.73 | v4.18,6.97 4.18,8.54 10.37,14.73 15.4,14.73
  Bottom 0.203: IC3.1 15.8,15.35 v15.4,14.95 | 33.99,13.31 25.59,13.31 v25.33,13.56 | IC5.VCC 2.61,4.19 2.61,5.4 v4.18,6.97 | 33.99,13.31 34.61,13.31 35.65,12.27 35.65,9 35.28,8.64 32.81,8.64 32.5,8.33 32.5,7 32.87,6.63 33.31,6.63 34.06,5.88 34.06,4.85 32.97,3.75 32.66,3.75 R4.1 | 33.99,13.31 33.99,16.2 32.91,17.29 JP2.4

### Text on the board
tPlace: TTN_MAD V2.2 ADAPTER
bPlace: GND | INT1 | GND / SCL / SDA / VCC / A1 / D6 / TXD / RXD / PIR / INT1
tNames: 3V3 | SW | GND | GND | D9 | DIO2 | DIO1 | D6 | D5 | D4 | D3 | DIO0 | GND | RST | RXD | TXD | www.iotopentech.io | RFM95 | SS | MOS | MIS | SCK | A0 | A1 | A2 | A3 | 3V3 | RST | GND | RAW | www.iotopentech.io | TTN_MAD Nodo V2.2
bNames: 3V3 | SW | GND | GND | www.iotopentech.io | www.iotopentech.io | TTN_MAD Nodo V2.2